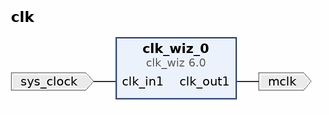
[diagram p0: block diagram of the top level]
# Vivado block design clk, xc7a100tcsg324-1, Vivado 2022.1
create_bd_design clk

create_bd_port -dir I -type clk sys_clock
set_property -dict {CONFIG.FREQ_HZ 100000000 CONFIG.PHASE 0.0} [get_bd_ports sys_clock]
create_bd_port -dir O -type clk mclk

create_bd_cell -type ip -vlnv xilinx.com:ip:clk_wiz:6.0 clk_wiz_0
set_property -dict [list \
  CONFIG.CLKOUT1_JITTER 390.763 \
  CONFIG.CLKOUT1_PHASE_ERROR 254.848 \
  CONFIG.CLKOUT1_REQUESTED_OUT_FREQ 11.29 \
  CONFIG.CLK_IN1_BOARD_INTERFACE sys_clock \
  CONFIG.MMCM_CLKFBOUT_MULT_F 34.375 \
  CONFIG.MMCM_CLKOUT0_DIVIDE_F 76.125 \
  CONFIG.MMCM_DIVCLK_DIVIDE 4 \
  CONFIG.RESET_BOARD_INTERFACE reset \
  CONFIG.USE_BOARD_FLOW true \
  CONFIG.USE_RESET false \
] [get_bd_cells clk_wiz_0]

# ---- connections ----

connect_bd_net [get_bd_pins clk_wiz_0/clk_out1] [get_bd_ports mclk]
connect_bd_net [get_bd_ports sys_clock] [get_bd_pins clk_wiz_0/clk_in1]

validate_bd_design
save_bd_design
